# EAGLE design PDU_v1a (EAGLE 6.5.0)

## Sheet 1 of 3
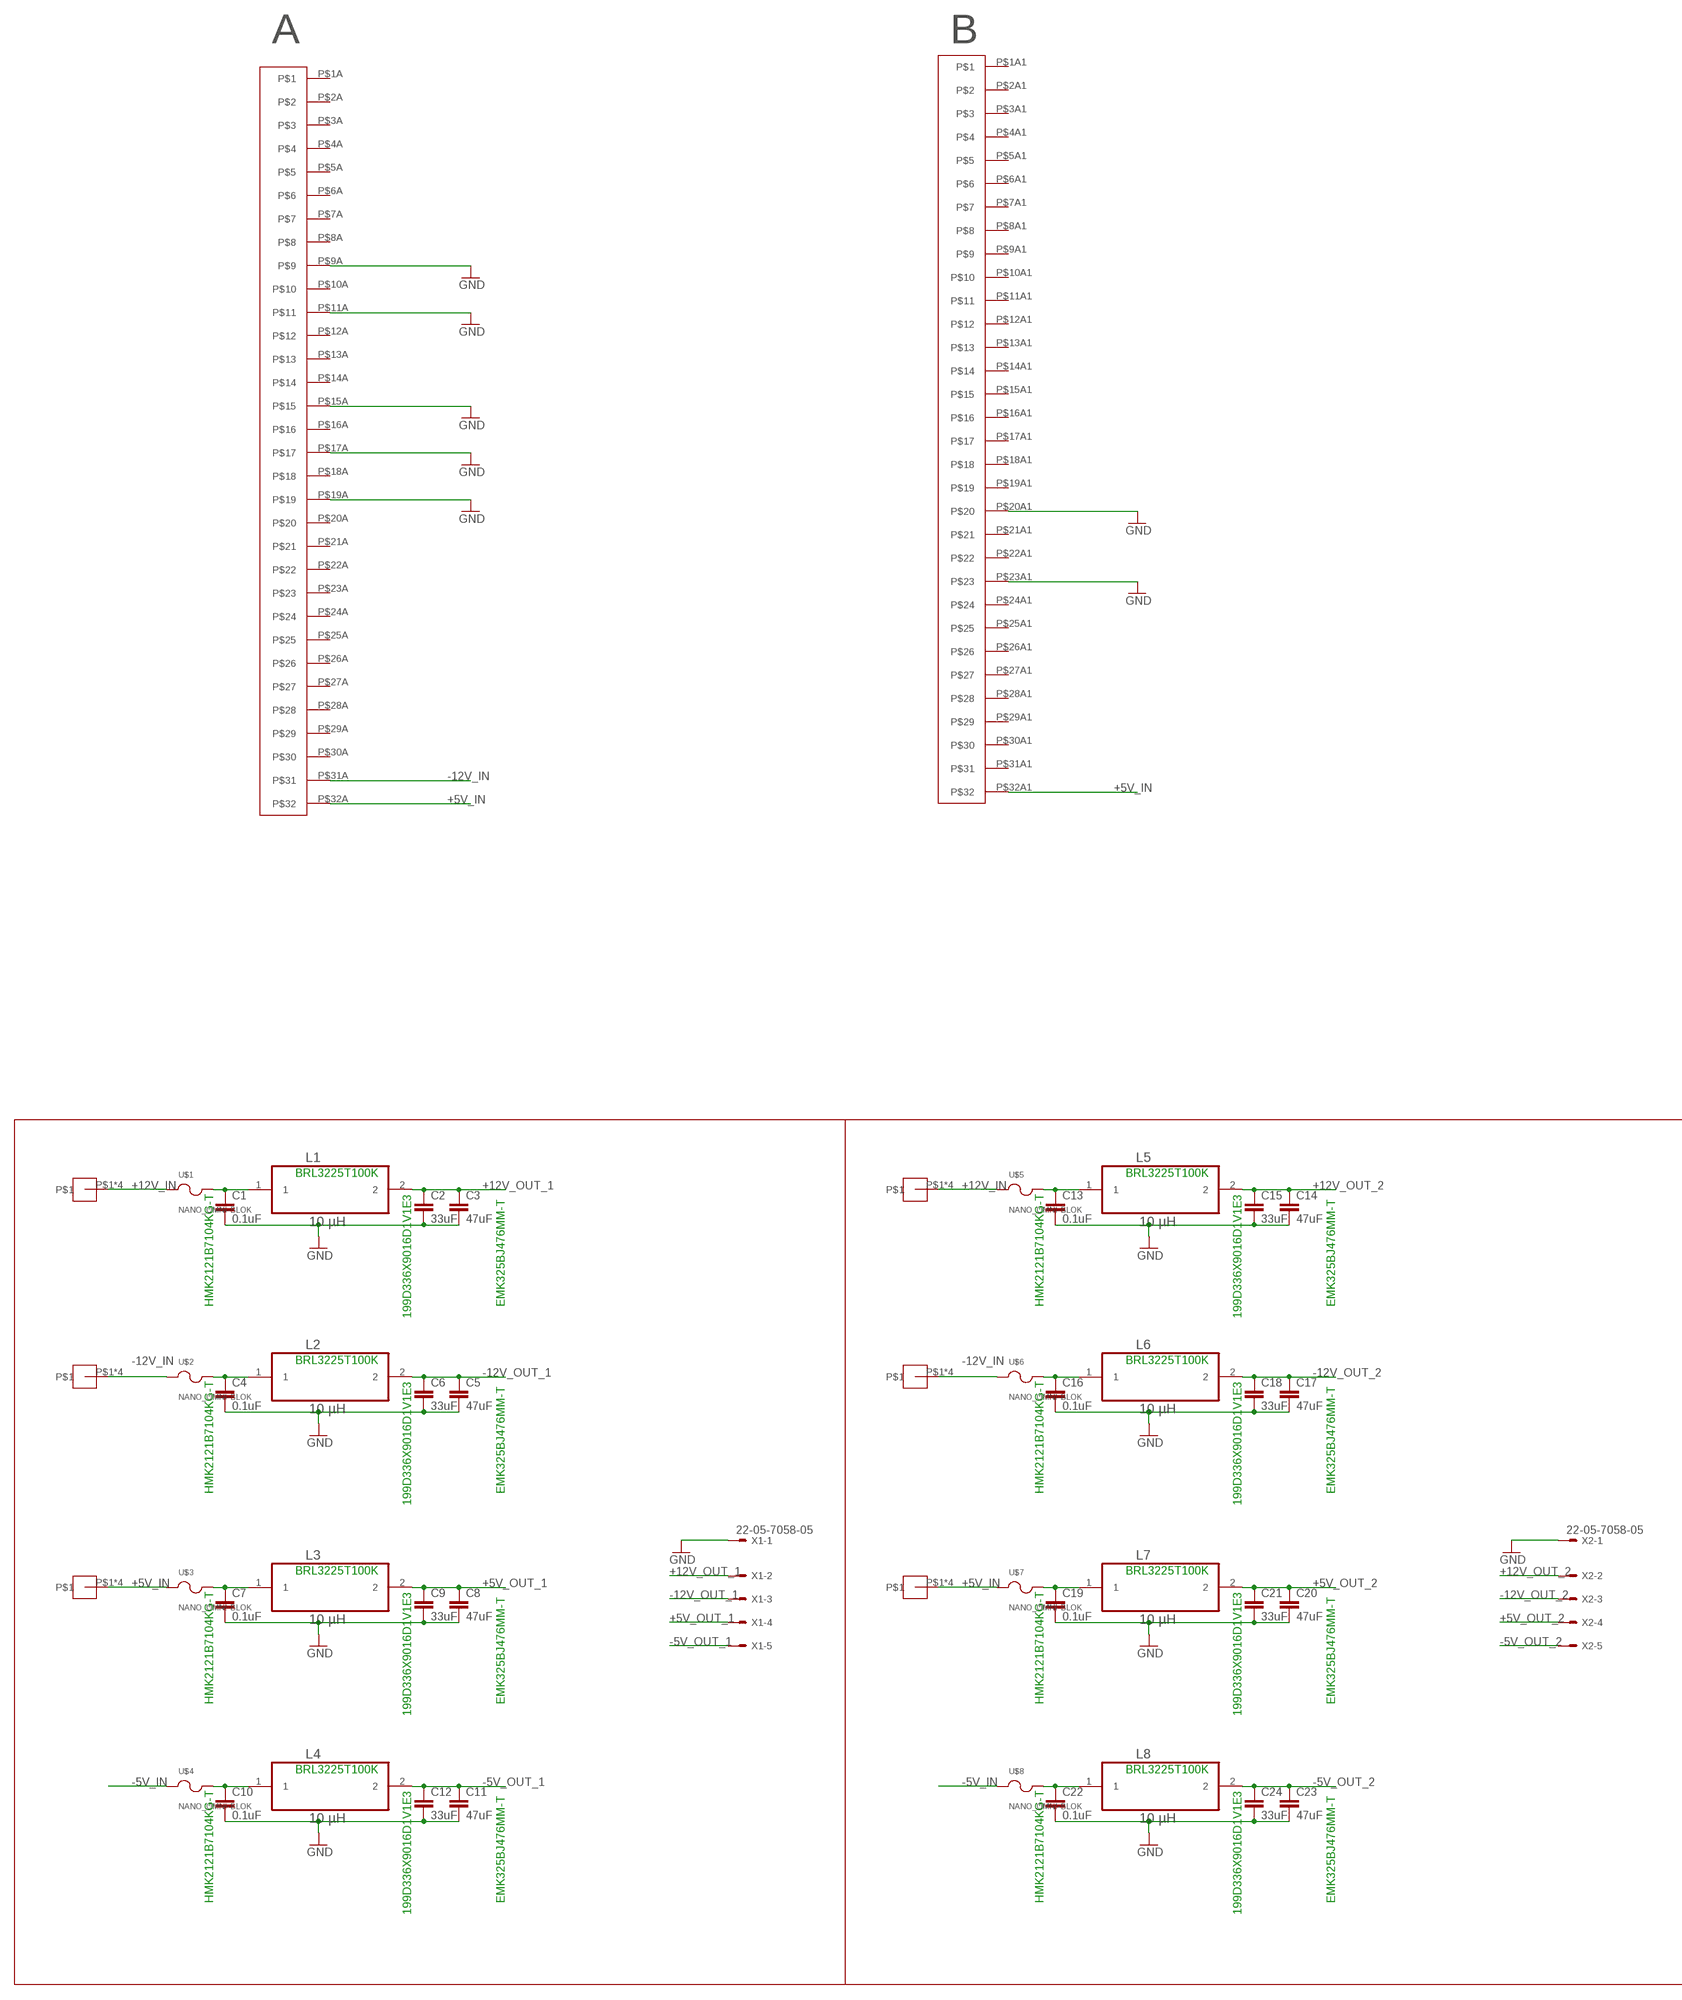
[diagram p0: schematic, sheet 1, part 1 of 2]
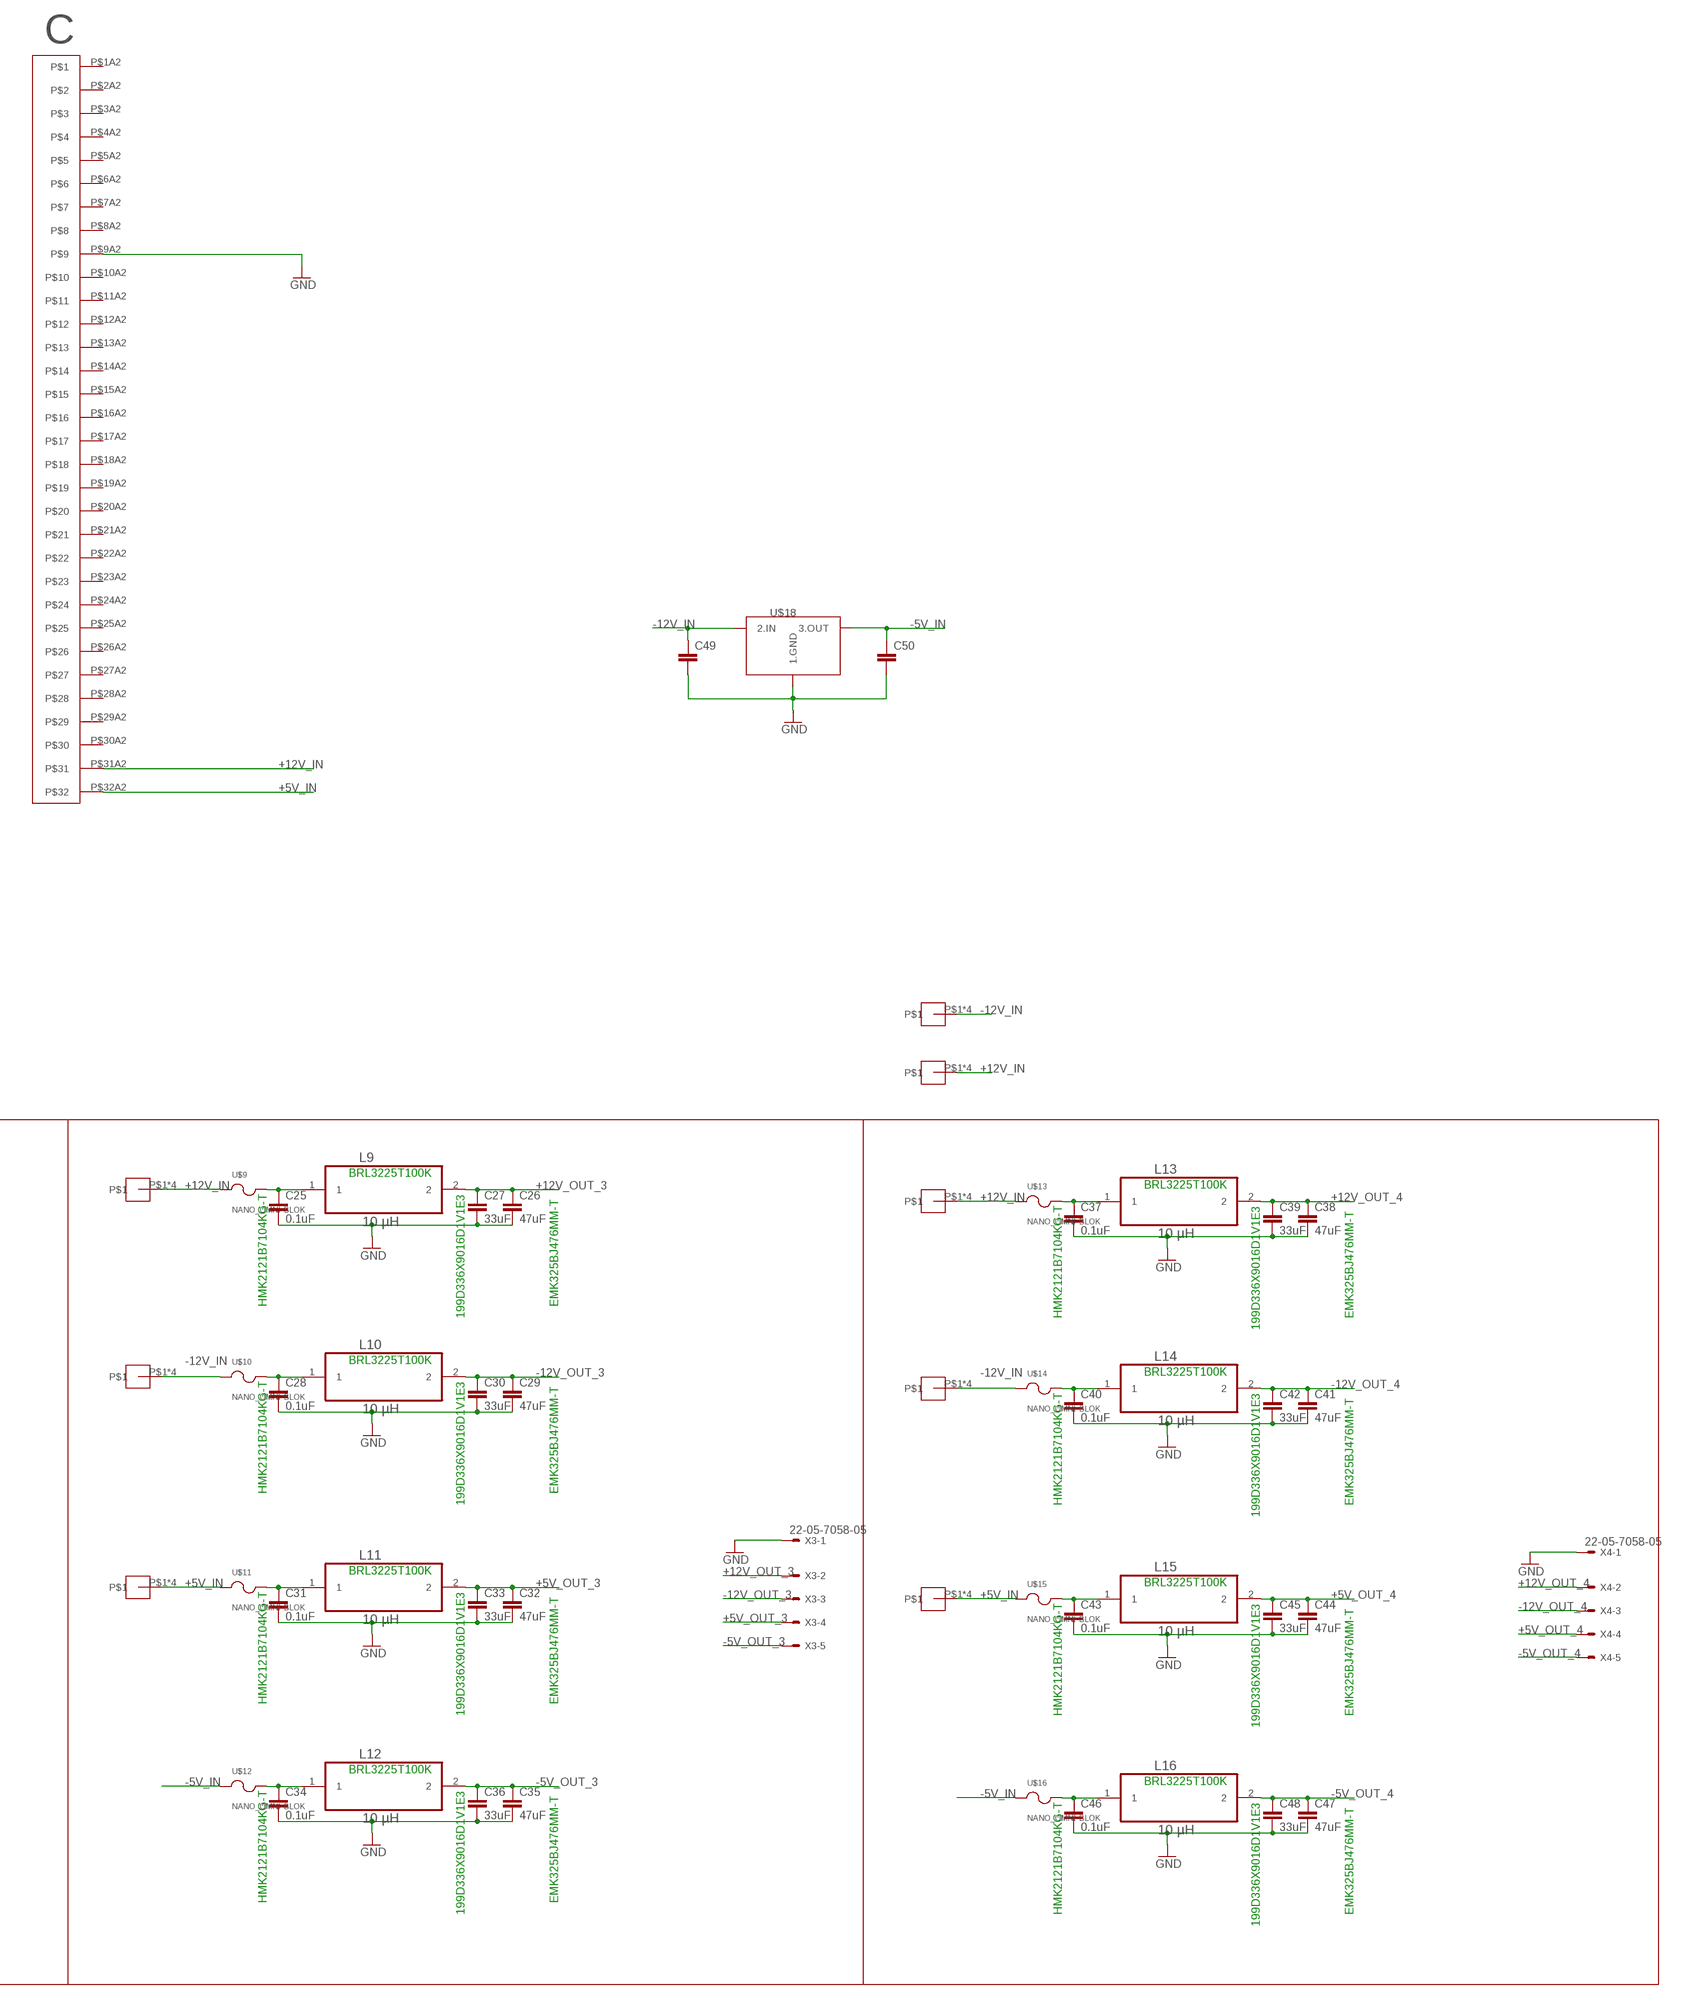
[diagram p1: schematic, sheet 1, part 2 of 2]

### Parts
+5V  POWERTAP-7691  [KEYSTONE7691]
+5V1  POWERTAP-7691  [KEYSTONE7691]
+5V2  POWERTAP-7691  [KEYSTONE7691]
+5V3  POWERTAP-7691  [KEYSTONE7691]
+12V  POWERTAP-7691  [KEYSTONE7691]
+12V1  POWERTAP-7691  [KEYSTONE7691]
+12V2  POWERTAP-7691  [KEYSTONE7691]
+12V3  POWERTAP-7691  [KEYSTONE7691]
+12V4  POWERTAP-7691  [KEYSTONE7691]
-12V  POWERTAP-7691  [KEYSTONE7691]
-12V1  POWERTAP-7691  [KEYSTONE7691]
-12V2  POWERTAP-7691  [KEYSTONE7691]
-12V3  POWERTAP-7691  [KEYSTONE7691]
-12V4  POWERTAP-7691  [KEYSTONE7691]
C1  0.1uF  C-EUC0805  [C0805]
C2  33uF  C-EU025-025X050  [C025-025X050]
C3  47uF  C-EUC1210  [C1210]
C4  0.1uF  C-EUC0805  [C0805]
C5  47uF  C-EUC1210  [C1210]
C6  33uF  C-EU025-025X050  [C025-025X050]
C7  0.1uF  C-EUC0805  [C0805]
C8  47uF  C-EUC1210  [C1210]
C9  33uF  C-EU025-025X050  [C025-025X050]
C10  0.1uF  C-EUC0805  [C0805]
C11  47uF  C-EUC1210  [C1210]
C12  33uF  C-EU025-025X050  [C025-025X050]
C13  0.1uF  C-EUC0805  [C0805]
C14  47uF  C-EUC1210  [C1210]
C15  33uF  C-EU025-025X050  [C025-025X050]
C16  0.1uF  C-EUC0805  [C0805]
C17  47uF  C-EUC1210  [C1210]
C18  33uF  C-EU025-025X050  [C025-025X050]
C19  0.1uF  C-EUC0805  [C0805]
C20  47uF  C-EUC1210  [C1210]
C21  33uF  C-EU025-025X050  [C025-025X050]
C22  0.1uF  C-EUC0805  [C0805]
C23  47uF  C-EUC1210  [C1210]
C24  33uF  C-EU025-025X050  [C025-025X050]
C25  0.1uF  C-EUC0805  [C0805]
C26  47uF  C-EUC1210  [C1210]
C27  33uF  C-EU025-025X050  [C025-025X050]
C28  0.1uF  C-EUC0805  [C0805]
C29  47uF  C-EUC1210  [C1210]
C30  33uF  C-EU025-025X050  [C025-025X050]
C31  0.1uF  C-EUC0805  [C0805]
C32  47uF  C-EUC1210  [C1210]
C33  33uF  C-EU025-025X050  [C025-025X050]
C34  0.1uF  C-EUC0805  [C0805]
C35  47uF  C-EUC1210  [C1210]
C36  33uF  C-EU025-025X050  [C025-025X050]
C37  0.1uF  C-EUC0805  [C0805]
C38  47uF  C-EUC1210  [C1210]
C39  33uF  C-EU025-025X050  [C025-025X050]
C40  0.1uF  C-EUC0805  [C0805]
C41  47uF  C-EUC1210  [C1210]
C42  33uF  C-EU025-025X050  [C025-025X050]
C43  0.1uF  C-EUC0805  [C0805]
C44  47uF  C-EUC1210  [C1210]
C45  33uF  C-EU025-025X050  [C025-025X050]
C46  0.1uF  C-EUC0805  [C0805]
C47  47uF  C-EUC1210  [C1210]
C48  33uF  C-EU025-025X050  [C025-025X050]
C49  C-EUC0805  [C0805]
C50  C-EUC0805  [C0805]
L1  10 µH  B82422H1333K  [INDC3225X240N]
L2  10 µH  B82422H1333K  [INDC3225X240N]
L3  10 µH  B82422H1333K  [INDC3225X240N]
L4  10 µH  B82422H1333K  [INDC3225X240N]
L5  10 µH  B82422H1333K  [INDC3225X240N]
L6  10 µH  B82422H1333K  [INDC3225X240N]
L7  10 µH  B82422H1333K  [INDC3225X240N]
L8  10 µH  B82422H1333K  [INDC3225X240N]
L9  10 µH  B82422H1333K  [INDC3225X240N]
L10  10 µH  B82422H1333K  [INDC3225X240N]
L11  10 µH  B82422H1333K  [INDC3225X240N]
L12  10 µH  B82422H1333K  [INDC3225X240N]
L13  10 µH  B82422H1333K  [INDC3225X240N]
L14  10 µH  B82422H1333K  [INDC3225X240N]
L15  10 µH  B82422H1333K  [INDC3225X240N]
L16  10 µH  B82422H1333K  [INDC3225X240N]
U$1  NANO_OMNI-BLOK  [NANO2-OMNI-BLOK]
U$2  NANO_OMNI-BLOK  [NANO2-OMNI-BLOK]
U$3  NANO_OMNI-BLOK  [NANO2-OMNI-BLOK]
U$4  NANO_OMNI-BLOK  [NANO2-OMNI-BLOK]
U$5  NANO_OMNI-BLOK  [NANO2-OMNI-BLOK]
U$6  NANO_OMNI-BLOK  [NANO2-OMNI-BLOK]
U$7  NANO_OMNI-BLOK  [NANO2-OMNI-BLOK]
U$8  NANO_OMNI-BLOK  [NANO2-OMNI-BLOK]
U$9  NANO_OMNI-BLOK  [NANO2-OMNI-BLOK]
U$10  NANO_OMNI-BLOK  [NANO2-OMNI-BLOK]
U$11  NANO_OMNI-BLOK  [NANO2-OMNI-BLOK]
U$12  NANO_OMNI-BLOK  [NANO2-OMNI-BLOK]
U$13  NANO_OMNI-BLOK  [NANO2-OMNI-BLOK]
U$14  NANO_OMNI-BLOK  [NANO2-OMNI-BLOK]
U$15  NANO_OMNI-BLOK  [NANO2-OMNI-BLOK]
U$16  NANO_OMNI-BLOK  [NANO2-OMNI-BLOK]
U$17  DIN_41612_PLUG  [DIN_41612_PLUG]
U$18  LM2990  [TO-263-3]
X1  22-05-7058-05  [7395-05]
X2  22-05-7058-05  [7395-05]
X3  22-05-7058-05  [7395-05]
X4  22-05-7058-05  [7395-05]

### Nets
+5V_1: C7.1 L3.1 U$3.P$2
+5V_2: C19.1 L7.1 U$7.P$2
+5V_3: C31.1 L11.1 U$11.P$2
+5V_4: C43.1 L15.1 U$15.P$2
+5V_IN: +5V1.P$1 +5V1.P$2 +5V1.P$3 +5V1.P$4 +5V2.P$1 +5V2.P$2 +5V2.P$3 +5V2.P$4 +5V3.P$1 +5V3.P$2 +5V3.P$3 +5V3.P$4 +5V.P$1 +5V.P$2 +5V.P$3 +5V.P$4 U$3.P$1 U$7.P$1 U$11.P$1 U$15.P$1 U$17.P$32A U$17.P$32A1 U$17.P$32A2
+5V_OUT_1: C8.1 C9.1 L3.2 X1.4
+5V_OUT_2: C20.1 C21.1 L7.2 X2.4
+5V_OUT_3: C32.1 C33.1 L11.2 X3.4
+5V_OUT_4: C44.1 C45.1 L15.2 X4.4
+12V_1: C1.1 L1.1 U$1.P$2
+12V_2: C13.1 L5.1 U$5.P$2
+12V_3: C25.1 L9.1 U$9.P$2
+12V_4: C37.1 L13.1 U$13.P$2
+12V_IN: +12V1.P$1 +12V1.P$2 +12V1.P$3 +12V1.P$4 +12V2.P$1 +12V2.P$2 +12V2.P$3 +12V2.P$4 +12V3.P$1 +12V3.P$2 +12V3.P$3 +12V3.P$4 +12V4.P$1 +12V4.P$2 +12V4.P$3 +12V4.P$4 +12V.P$1 +12V.P$2 +12V.P$3 +12V.P$4 U$1.P$1 U$5.P$1 U$9.P$1 U$13.P$1 U$17.P$31A2
+12V_OUT_1: C2.1 C3.1 L1.2 X1.2
+12V_OUT_2: C14.1 C15.1 L5.2 X2.2
+12V_OUT_3: C26.1 C27.1 L9.2 X3.2
+12V_OUT_4: C38.1 C39.1 L13.2 X4.2
-5V_1: C10.1 L4.1 U$4.P$2
-5V_2: C22.1 L8.1 U$8.P$2
-5V_3: C34.1 L12.1 U$12.P$2
-5V_4: C46.1 L16.1 U$16.P$2
-5V_IN: C50.1 U$4.P$1 U$8.P$1 U$12.P$1 U$16.P$1 U$18.P$3(3.OUT)
-5V_OUT_1: C11.1 C12.1 L4.2 X1.5
-5V_OUT_2: C23.1 C24.1 L8.2 X2.5
-5V_OUT_3: C35.1 C36.1 L12.2 X3.5
-5V_OUT_4: C47.1 C48.1 L16.2 X4.5
-12V_1: C4.1 L2.1 U$2.P$2
-12V_2: C16.1 L6.1 U$6.P$2
-12V_3: C28.1 L10.1 U$10.P$2
-12V_4: C40.1 L14.1 U$14.P$2
-12V_IN: -12V1.P$1 -12V1.P$2 -12V1.P$3 -12V1.P$4 -12V2.P$1 -12V2.P$2 -12V2.P$3 -12V2.P$4 -12V3.P$1 -12V3.P$2 -12V3.P$3 -12V3.P$4 -12V4.P$1 -12V4.P$2 -12V4.P$3 -12V4.P$4 -12V.P$1 -12V.P$2 -12V.P$3 -12V.P$4 C49.1 U$2.P$1 U$6.P$1 U$10.P$1 U$14.P$1 U$17.P$31A U$18.P$2(2.IN) U$18.P$4(2.IN)
-12V_OUT_1: C5.1 C6.1 L2.2 X1.3
-12V_OUT_2: C17.1 C18.1 L6.2 X2.3
-12V_OUT_3: C29.1 C30.1 L10.2 X3.3
-12V_OUT_4: C41.1 C42.1 L14.2 X4.3
GND: C1.2 C2.2 C3.2 C4.2 C5.2 C6.2 C7.2 C8.2 C9.2 C10.2 C11.2 C12.2 C13.2 C14.2 C15.2 C16.2 C17.2 C18.2 C19.2 C20.2 C21.2 C22.2 C23.2 C24.2 C25.2 C26.2 C27.2 C28.2 C29.2 C30.2 C31.2 C32.2 C33.2 C34.2 C35.2 C36.2 C37.2 C38.2 C39.2 C40.2 C41.2 C42.2 C43.2 C44.2 C45.2 C46.2 C47.2 C48.2 C49.2 C50.2 U$17.P$9A U$17.P$9A2 U$17.P$11A U$17.P$15A U$17.P$17A U$17.P$19A U$17.P$20A1 U$17.P$23A1 U$18.P$1(1.GND) X1.1 X2.1 X3.1 X4.1
Unconnected: U$17.P$1A U$17.P$1A1 U$17.P$1A2 U$17.P$2A U$17.P$2A1 U$17.P$2A2 U$17.P$3A U$17.P$3A1 U$17.P$3A2 U$17.P$4A U$17.P$4A1 U$17.P$4A2 U$17.P$5A U$17.P$5A1 U$17.P$5A2 U$17.P$6A U$17.P$6A1 U$17.P$6A2 U$17.P$7A U$17.P$7A1 U$17.P$7A2 U$17.P$8A U$17.P$8A1 U$17.P$8A2 U$17.P$9A1 U$17.P$10A U$17.P$10A1 U$17.P$10A2 U$17.P$11A1 U$17.P$11A2 U$17.P$12A U$17.P$12A1 U$17.P$12A2 U$17.P$13A U$17.P$13A1 U$17.P$13A2 U$17.P$14A U$17.P$14A1 U$17.P$14A2 U$17.P$15A1 U$17.P$15A2 U$17.P$16A U$17.P$16A1 U$17.P$16A2 U$17.P$17A1 U$17.P$17A2 U$17.P$18A U$17.P$18A1 U$17.P$18A2 U$17.P$19A1 U$17.P$19A2 U$17.P$20A U$17.P$20A2 U$17.P$21A U$17.P$21A1 U$17.P$21A2 U$17.P$22A U$17.P$22A1 U$17.P$22A2 U$17.P$23A U$17.P$23A2 U$17.P$24A U$17.P$24A1 U$17.P$24A2 U$17.P$25A U$17.P$25A1 U$17.P$25A2 U$17.P$26A U$17.P$26A1 U$17.P$26A2 U$17.P$27A U$17.P$27A1 U$17.P$27A2 U$17.P$28A U$17.P$28A1 U$17.P$28A2 U$17.P$29A U$17.P$29A1 U$17.P$29A2 U$17.P$30A U$17.P$30A1 U$17.P$30A2 U$17.P$31A1

### Notes on the sheet
- A | B | C
- BRL3225T100K | BRL3225T100K | BRL3225T100K
- BRL3225T100K
- HMK2121B7104KG-T | EMK325BJ476MM-T | HMK2121B7104KG-T | EMK325BJ476MM-T | HMK2121B7104KG-T | EMK325BJ476MM-T
- 199D336X9016D1V1E3 | 199D336X9016D1V1E3 | 199D336X9016D1V1E3 | HMK2121B7104KG-T | EMK325BJ476MM-T
- 199D336X9016D1V1E3
- BRL3225T100K | BRL3225T100K | BRL3225T100K
- BRL3225T100K
- HMK2121B7104KG-T | EMK325BJ476MM-T | HMK2121B7104KG-T | EMK325BJ476MM-T | HMK2121B7104KG-T | EMK325BJ476MM-T
- 199D336X9016D1V1E3 | 199D336X9016D1V1E3 | 199D336X9016D1V1E3 | HMK2121B7104KG-T | EMK325BJ476MM-T
- 199D336X9016D1V1E3
- BRL3225T100K | BRL3225T100K | BRL3225T100K
- BRL3225T100K
- HMK2121B7104KG-T | EMK325BJ476MM-T | HMK2121B7104KG-T | EMK325BJ476MM-T | HMK2121B7104KG-T | EMK325BJ476MM-T
- 199D336X9016D1V1E3 | 199D336X9016D1V1E3 | 199D336X9016D1V1E3 | HMK2121B7104KG-T | EMK325BJ476MM-T
- 199D336X9016D1V1E3
- BRL3225T100K | BRL3225T100K | BRL3225T100K
- BRL3225T100K
- HMK2121B7104KG-T | EMK325BJ476MM-T | HMK2121B7104KG-T | EMK325BJ476MM-T | HMK2121B7104KG-T | EMK325BJ476MM-T
- 199D336X9016D1V1E3 | 199D336X9016D1V1E3 | 199D336X9016D1V1E3 | HMK2121B7104KG-T | EMK325BJ476MM-T
- 199D336X9016D1V1E3

## Sheet 2 of 3

## Sheet 3 of 3

## Library data of the parts
+5V +5V1-+5V3 +12V +12V1-+12V4 -12V -12V1--12V4 = PowerTaps:POWERTAP-7691
C1-C50 = rcl:C-EU: CAPACITOR, European symbol
L1-L16 = Epcos_By_element14_Batch_1:B82422H1333K: INDUCTOR 33UH 280MA 1210 10%; MPN: B82422H1333K; OC_FARNELL: 1299977; OC_NEWARK: 25M8338; SUPPLIER: EPCOS Inc; TOLERANCE: ±10%; VALUE: 33 µH
U$1-U$16 = ad8512:NANO_OMNI-BLOK
U$17 = ebutt:DIN_41612_PLUG
U$18 = ebutt:LM2990
X1-X4 = con-molex:22-?-05: CONNECTOR wire to board 2.54 mm (.1 inch) pitch header; OC_FARNELL: unknown; OC_NEWARK: unknown

## Board
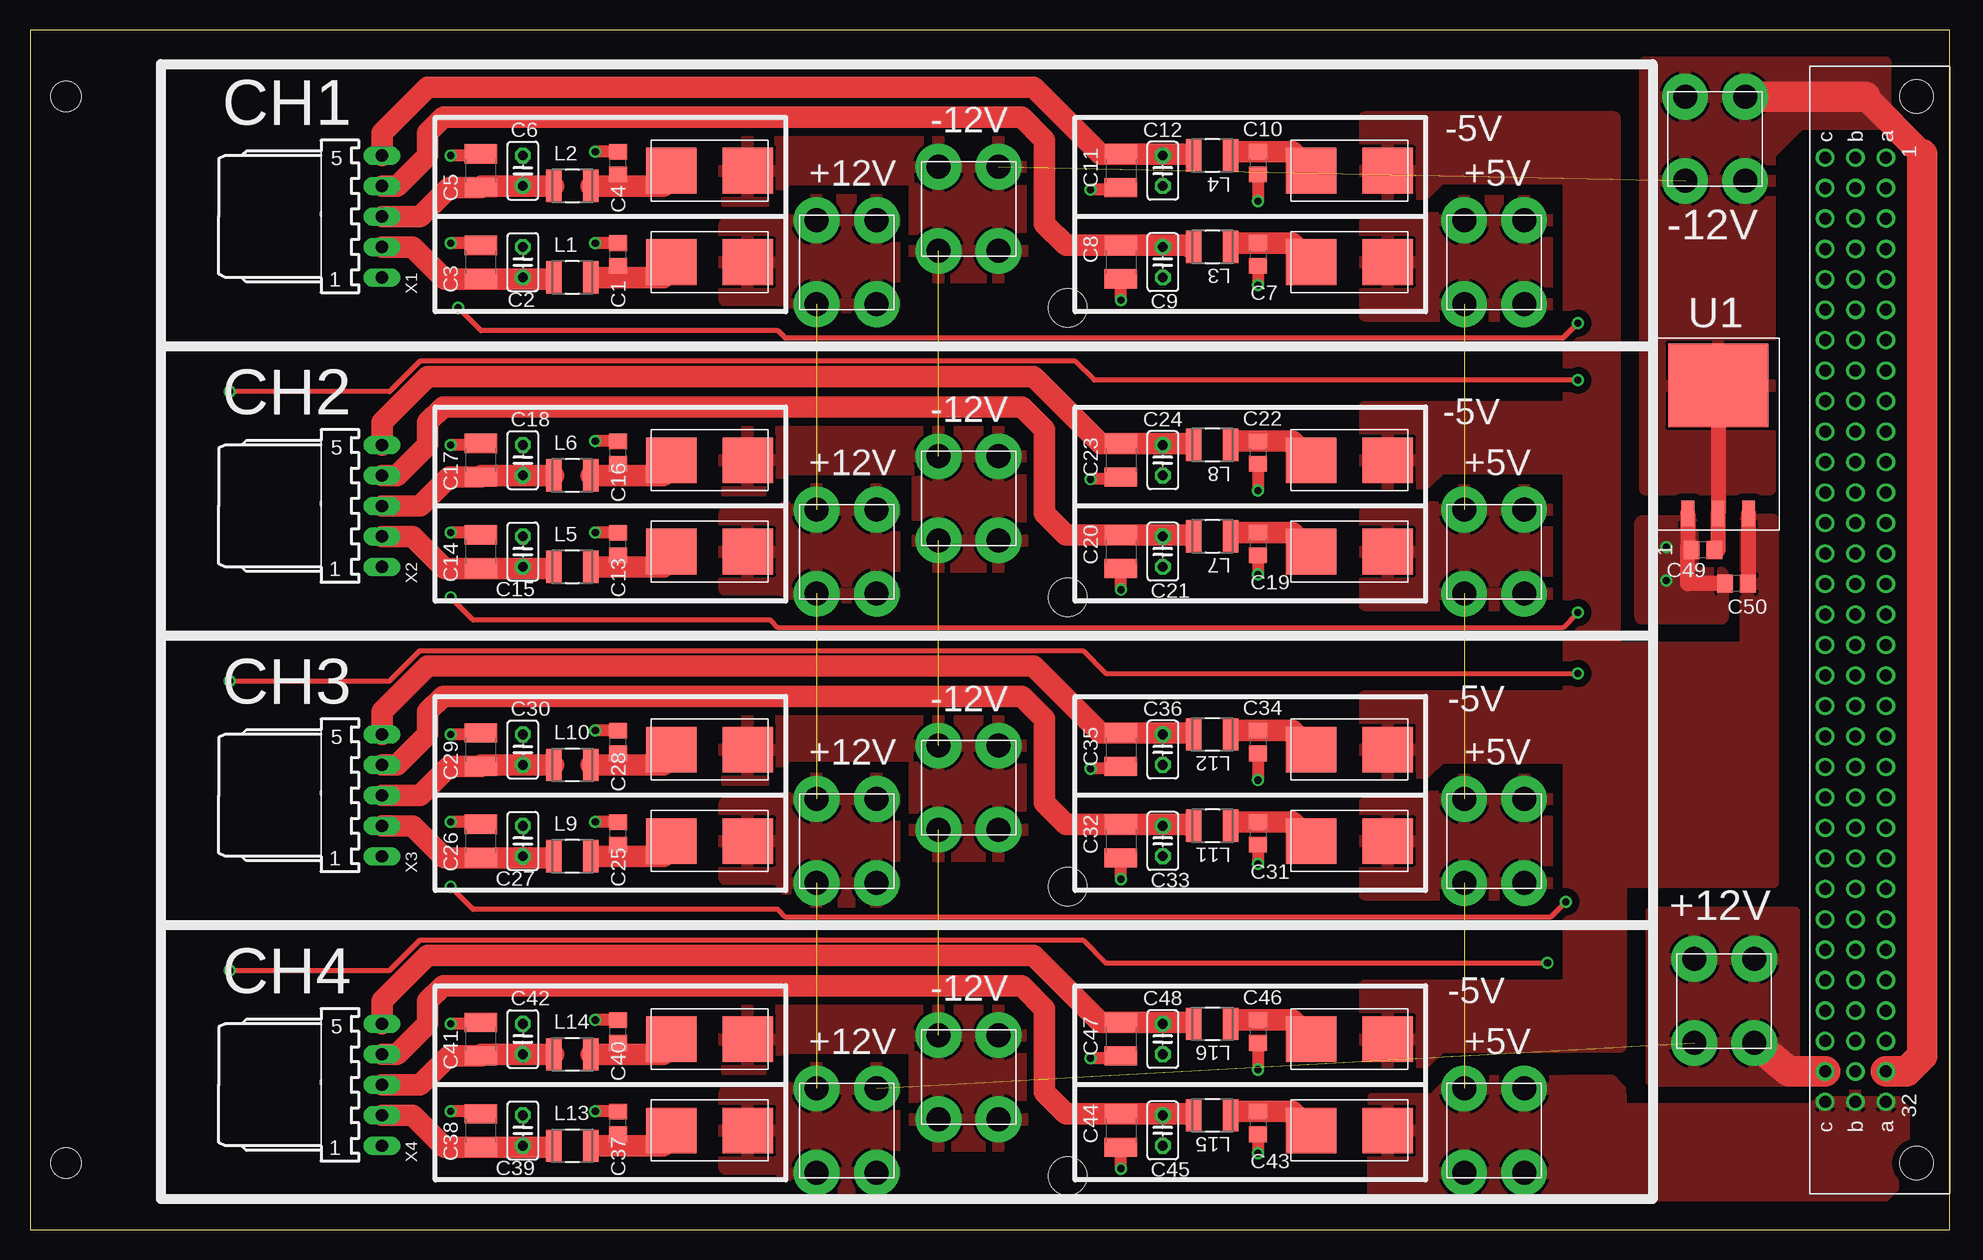
[diagram p2: board, top side]
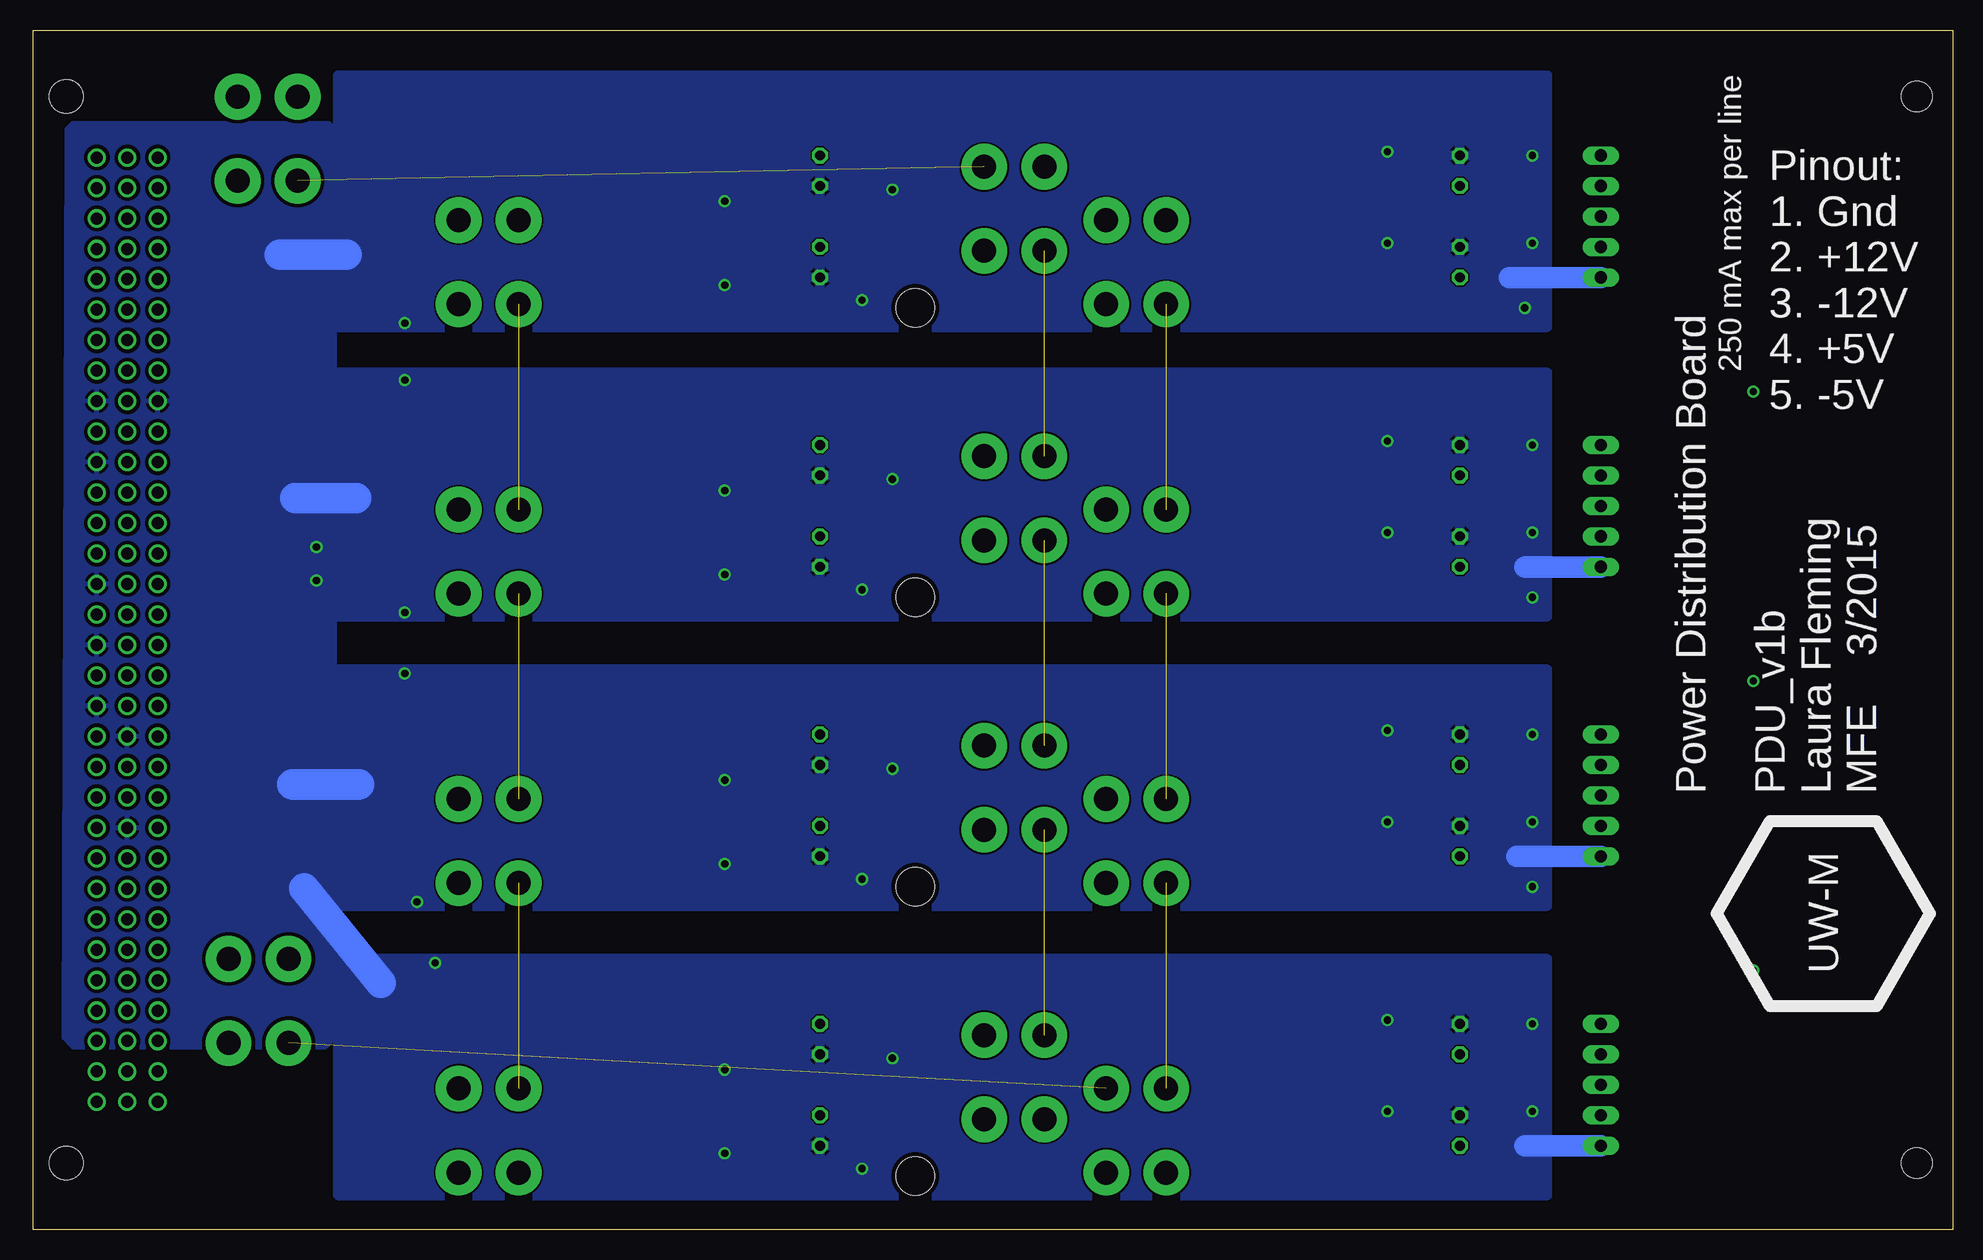
[diagram p3: board, bottom side, seen from below]

Size 160 x 100 mm. Coordinates in mm from the lower left corner, seen from the top.
Outline: 0,0 160,0 160,100 0,100 0,0
Copper layers (1*16): Top 0.035559375mm / dielectric 1.501140625mm / Bottom 0.035559375mm
Design rules "typical_4pcb": minimum track width 10mil, minimum drill 15mil, track to track 6mil, track to pad 6mil, pad to pad 6mil, via to via 6mil, smd to smd 6mil, copper to edge 15mil, drill to drill 8mil, minimum pad ring 10mil, minimum via ring 8mil, stop-mask expansion 4mil, vias tented up to drill 20mil, thermal gap 10mil
Holes 3.2 mm at 86.49,76.83 86.49,52.7 86.49,28.57 86.49,4.45
Holes 2.55 mm at 3,5.55 3,94.45

### Footprints (pad centres in the part's own frame; a part is rotated, then mirrored left to right if it is on the bottom)
KEYSTONE7691 = drill 2 pad 3.81: P$1 -3.505,-2.502; P$2 -3.505,2.502; P$3 3.505,-2.502; P$4 3.505,2.502
C0805 = smd 1.3 x 1.5: 1 -0.95,0; 2 0.95,0
C025-025X050 = drill 0.813 octagon: 1 -1.27,0; 2 1.27,0
C1210 = smd 1.6 x 2.7: 1 -1.4,0; 2 1.4,0
INDC3225X240N = smd 1.295 x 2.692: 1 -1.549,0; 2 1.549,0
NANO2-OMNI-BLOK = smd 4.242 x 3.81: P$1 -3.188,0; P$2 3.188,0
DIN_41612_PLUG = drill 1: P$1A 39.37,0; P$1A1 39.37,2.54; P$1A2 39.37,5.08; P$2A 36.83,0; P$2A1 36.83,2.54; P$2A2 36.83,5.08; P$3A 34.29,0; P$3A1 34.29,2.54; P$3A2 34.29,5.08; P$4A 31.75,0; P$4A1 31.75,2.54; P$4A2 31.75,5.08; P$5A 29.21,0; P$5A1 29.21,2.54; P$5A2 29.21,5.08; P$6A 26.67,0; P$6A1 26.67,2.54; P$6A2 26.67,5.08; P$7A 24.13,0; P$7A1 24.13,2.54; P$7A2 24.13,5.08; P$8A 21.59,0; P$8A1 21.59,2.54; P$8A2 21.59,5.08; P$9A 19.05,0; P$9A1 19.05,2.54; P$9A2 19.05,5.08; P$10A 16.51,0; P$10A1 16.51,2.54; P$10A2 16.51,5.08; P$11A 13.97,0; P$11A1 13.97,2.54; P$11A2 13.97,5.08; P$12A 11.43,0; P$12A1 11.43,2.54; P$12A2 11.43,5.08; P$13A 8.89,0; P$13A1 8.89,2.54; P$13A2 8.89,5.08; P$14A 6.35,0; P$14A1 6.35,2.54; P$14A2 6.35,5.08; P$15A 3.81,0; P$15A1 3.81,2.54; P$15A2 3.81,5.08; P$16A 1.27,0; P$16A1 1.27,2.54; P$16A2 1.27,5.08; P$17A -1.27,0; P$17A1 -1.27,2.54; P$17A2 -1.27,5.08; P$18A -3.81,0; P$18A1 -3.81,2.54; P$18A2 -3.81,5.08; P$19A -6.35,0; P$19A1 -6.35,2.54; P$19A2 -6.35,5.08; P$20A -8.89,0; P$20A1 -8.89,2.54; P$20A2 -8.89,5.08; P$21A -11.43,0; P$21A1 -11.43,2.54; P$21A2 -11.43,5.08; P$22A -13.97,0; P$22A1 -13.97,2.54; P$22A2 -13.97,5.08; P$23A -16.51,0; P$23A1 -16.51,2.54; P$23A2 -16.51,5.08; P$24A -19.05,0; P$24A1 -19.05,2.54; P$24A2 -19.05,5.08; P$25A -21.59,0; P$25A1 -21.59,2.54; P$25A2 -21.59,5.08; P$26A -24.13,0; P$26A1 -24.13,2.54; P$26A2 -24.13,5.08; P$27A -26.67,0; P$27A1 -26.67,2.54; P$27A2 -26.67,5.08; P$28A -29.21,0; P$28A1 -29.21,2.54; P$28A2 -29.21,5.08; P$29A -31.75,0; P$29A1 -31.75,2.54; P$29A2 -31.75,5.08; P$30A -34.29,0; P$30A1 -34.29,2.54; P$30A2 -34.29,5.08; P$31A -36.83,0; P$31A1 -36.83,2.54; P$31A2 -36.83,5.08; P$32A -39.37,0; P$32A1 -39.37,2.54; P$32A2 -39.37,5.08 | hole 2.8: 44.45,-2.54; -44.45,-2.54
TO-263-3 = smd 2.159 x 1.067: P$1 0,-2.54; P$2 0,0; P$3 0,2.54 | smd 6.985 x 8.331: P$4 -10.681,0
7395-05 = drill 1.016 long: 1 5.08,0; 2 2.54,0; 3 0,0; 4 -2.54,0; 5 -5.08,0

### Placement (x,y rotation side)
+5V  122.05,80.64 90 top
+5V1  122.05,56.52 90 top
+5V2  122.05,32.38 90 top
+5V3  122.05,8.26 90 top
+12V  68.07,80.64 270 top
+12V1  68.07,56.52 270 top
+12V2  68.07,32.38 270 top
+12V3  68.07,8.26 270 top
+12V4  141.22,19.05 90 top
-12V  78.23,85.09 90 top
-12V1  78.23,60.96 90 top
-12V2  78.23,36.83 90 top
-12V3  78.23,12.7 90 top
-12V4  140.46,90.93 90 top
C1  49.02,81.28 90 top
C2  41.08,80.64 90 top
C3  37.59,80.64 90 top
C4  49.02,88.9 90 top
C5  37.59,88.27 90 top
C6  41.08,88.27 90 top
C7  102.36,81.28 270 top
C8  90.93,80.64 270 top
C9  94.42,80.64 270 top
C10  102.36,88.9 270 top
C11  90.93,88.27 270 top
C12  94.42,88.27 270 top
C13  49.02,57.15 90 top
C14  37.59,56.52 90 top
C15  41.08,56.52 90 top
C16  49.02,64.77 90 top
C17  37.59,64.14 90 top
C18  41.08,64.14 90 top
C19  102.36,57.15 270 top
C20  90.93,56.52 270 top
C21  94.42,56.52 270 top
C22  102.36,64.77 270 top
C23  90.93,64.14 270 top
C24  94.42,64.14 270 top
C25  49.02,33.02 90 top
C26  37.59,32.38 90 top
C27  41.08,32.38 90 top
C28  49.02,40.64 90 top
C29  37.59,40.01 90 top
C30  41.08,40.01 90 top
C31  102.36,33.02 270 top
C32  90.93,32.38 270 top
C33  94.42,32.38 270 top
C34  102.36,40.64 270 top
C35  90.93,40.01 270 top
C36  94.42,40.01 270 top
C37  49.02,8.89 90 top
C38  37.59,8.26 90 top
C39  41.08,8.26 90 top
C40  49.02,16.51 90 top
C41  37.59,15.88 90 top
C42  41.08,15.88 90 top
C43  102.36,8.89 270 top
C44  90.93,8.26 270 top
C45  94.42,8.26 270 top
C46  102.36,16.51 270 top
C47  90.93,15.88 270 top
C48  94.42,15.88 270 top
C49  139.45,56.64 180 top
C50  142.24,53.85 180 top
L1  45.21,79.38 180 top
L2  45.21,87 180 top
L3  98.55,81.92 180 top
L4  98.55,89.53 180 top
L5  45.21,55.24 180 top
L6  45.21,62.87 180 top
L7  98.55,57.78 180 top
L8  98.55,65.41 180 top
L9  45.21,31.11 180 top
L10  45.21,38.73 180 top
L11  98.55,33.66 180 top
L12  98.55,41.27 180 top
L13  45.21,6.99 180 top
L14  45.21,14.61 180 top
L15  98.55,9.53 180 top
L16  98.55,17.14 180 top
U$1  56.64,80.64 180 top
U$2  56.64,88.27 180 top
U$3  109.98,80.64 180 top
U$4  109.98,88.27 180 top
U$5  56.64,56.52 180 top
U$6  56.64,64.14 180 top
U$7  109.98,56.52 180 top
U$8  109.98,64.14 180 top
U$9  56.64,32.38 180 top
U$10  56.64,40.01 180 top
U$11  109.98,32.38 180 top
U$12  109.98,40.01 180 top
U$13  56.64,8.26 180 top
U$14  56.64,15.88 180 top
U$15  109.98,8.26 180 top
U$16  109.98,15.88 180 top
U$17  154.71,50 90 top
U$18  140.72,59.69 270 top
X1  29.34,84.45 270 top
X2  29.34,60.33 270 top
X3  29.34,36.2 270 top
X4  29.34,12.06 270 top

### Tracks (layer width: path | path; a pad name or v marks a point on that pad's centre or on a via)
+5V_1
  Top 1.27: 100.42,82.23 L3.1
  Top 1.778: 100.42,82.23 C7.1 105.21,82.23 U$3.P$2
+5V_2
  Top 1.27: 100.42,58.1 L7.1
  Top 1.778: 100.42,58.1 C19.1 105.21,58.1 U$7.P$2
+5V_3
  Top 1.27: 100.42,33.97 L11.1
  Top 1.778: 100.42,33.97 C31.1 105.21,33.97 U$11.P$2
+5V_4
  Top 1.27: 100.42,9.84 L15.1
  Top 1.778: 100.42,9.84 C43.1 105.21,9.84 U$15.P$2
+5V_IN  (3 unrouted)
  pour Top (isolate 0.61): 111.25,83.82 111.25,76.2 126.49,76.2 126.49,85.72 118.24,85.72 116.33,83.82
  pour Top (isolate 0.61): 111.25,59.69 111.25,52.07 126.49,52.07 126.49,61.59 118.24,61.59 116.33,59.69
  pour Top (isolate 0.61): 111.25,35.56 111.25,27.94 126.49,27.94 126.49,37.47 118.24,37.47 116.33,35.56
  pour Top (isolate 0.61): 149.75,11.2 155,11.2 156.2,10 156.2,4.4 154.6,2.8 116.78,2.8 115.58,2.73 111.96,2.73 111.97,5.26 111.97,9.06 111.9,10.9 116.98,10.9 118.48,12.4 124.48,12.4 131.77,12.48 132.53,11.66 132.61,10.06 148.61,10.06
+5V_OUT_1
  Top 1.27: L3.2 96.65,81.92 | C9.1 94.87,82.05 95.38,82.05
  Top 1.778: X1.4 30.61,87 33.15,89.53 33.15,91.44 34.42,92.71 82.68,92.71 84.58,90.81 84.58,83.82 86.36,82.05 C8.1 95.38,82.05 96.52,82.05 96.65,81.92
+5V_OUT_2
  Top 1.27: L7.2 96.65,57.78 | C21.1 94.87,57.91 95.38,57.91
  Top 1.778: X2.4 30.61,62.87 33.15,65.41 33.15,67.31 34.42,68.58 82.68,68.58 84.58,66.67 84.58,59.69 86.36,57.91 C20.1 95.38,57.91 96.52,57.91 96.65,57.78
+5V_OUT_3
  Top 1.27: L11.2 96.65,33.66 | C33.1 94.87,33.78 95.38,33.78
  Top 1.778: X3.4 30.61,38.73 33.15,41.27 33.15,43.18 34.42,44.45 82.68,44.45 84.58,42.55 84.58,35.56 86.36,33.78 C32.1 95.38,33.78 96.52,33.78 96.65,33.66
+5V_OUT_4
  Top 1.27: L15.2 96.65,9.53 | C45.1 94.87,9.65 95.38,9.65
  Top 1.778: X4.4 30.61,14.61 33.15,17.14 33.15,19.05 34.42,20.32 82.68,20.32 84.58,18.41 84.58,11.43 86.36,9.65 C44.1 95.38,9.65 96.52,9.65 96.65,9.53
+12V_1
  Top 0.406: 51.56,79.69 51.56,79.38 52.83,79.38 53.45,79.38 U$1.P$2
  Top 1.016: C1.1 49.02,79.38
  Top 1.27: L1.1 47.12,79.38
  Top 1.778: 52.83,79.38 49.02,79.38 47.12,79.38
+12V_2
  Top 0.406: 51.56,55.56 51.56,55.24 52.83,55.24 53.45,55.24 U$5.P$2
  Top 1.016: C13.1 49.02,55.24
  Top 1.27: L5.1 47.12,55.24
  Top 1.778: 52.83,55.24 49.02,55.24 47.12,55.24
+12V_3
  Top 0.406: 51.56,31.43 51.56,31.11 52.83,31.11 53.45,31.11 U$9.P$2
  Top 1.016: C25.1 49.02,31.11
  Top 1.27: L9.1 47.12,31.11
  Top 1.778: 52.83,31.11 49.02,31.11 47.12,31.11
+12V_4
  Top 0.406: 51.56,7.3 51.56,6.99 52.83,6.99 53.45,6.99 U$13.P$2
  Top 1.016: C37.1 49.02,6.99
  Top 1.27: L13.1 47.12,6.99
  Top 1.778: 52.83,6.99 49.02,6.99 47.12,6.99
+12V_IN  (4 unrouted)
  Top 2.54: U$17.P$31A2 146.61,13.17 +12V4.P$1
  pour Top (isolate 0.61): 57.91,83.82 62.61,83.82 64.64,85.85 70.99,85.85 72.01,85.09 72.01,76.83 65.53,76.83 62.36,77.47 57.91,77.47
  pour Top (isolate 0.61): 57.91,59.69 62.36,59.69 64.39,61.72 70.74,61.72 72.01,60.45 72.01,52.7 64.26,52.7 62.36,53.34 57.91,53.34
  pour Top (isolate 0.61): 57.91,35.56 62.36,35.56 64.9,37.59 71.25,37.59 72.01,36.83 72.01,28.57 70.48,27.05 64.01,27.05 62.36,29.21 57.91,29.21
  pour Top (isolate 0.61): 57.91,11.43 62.36,11.43 64.9,13.46 71.25,13.46 72.01,12.7 72.01,4.45 71.25,3.17 64.26,3.17 62.36,5.08 57.91,5.08
  pour Top (isolate 0.406): 135.13,26.42 135.13,12.45 147.07,12.45 147.07,26.42
+12V_OUT_1
  Top 1.27: L1.2 43.31,79.38 43.18,79.25 | C2.1 41.08,79.25
  Top 1.778: X1.2 31.88,81.92 34.55,79.25 C3.1 41.08,79.25 43.18,79.25
+12V_OUT_2
  Top 1.27: L5.2 43.31,55.24 43.18,55.12 | C15.1 41.08,55.12
  Top 1.778: X2.2 31.88,57.78 34.55,55.12 C14.1 41.08,55.12 43.18,55.12
+12V_OUT_3
  Top 1.27: L9.2 43.31,31.11 43.18,30.98 | C27.1 41.08,30.98
  Top 1.778: X3.2 31.88,33.66 34.55,30.98 C26.1 41.08,30.98 43.18,30.98
+12V_OUT_4
  Top 1.27: L13.2 43.31,6.99 43.18,6.86 | C39.1 41.08,6.86
  Top 1.778: X4.2 31.88,9.53 34.55,6.86 C38.1 41.08,6.86 43.18,6.86
-5V_1
  Top 1.27: L4.1 100.46,89.53 100.46,89.85
  Top 1.778: U$4.P$2 105.21,89.85 C10.1 100.46,89.85
-5V_2
  Top 1.27: L8.1 100.46,65.41 100.46,65.72
  Top 1.778: U$8.P$2 105.21,65.72 C22.1 100.46,65.72
-5V_3
  Top 1.27: L12.1 100.46,41.27 100.46,41.59
  Top 1.778: U$12.P$2 105.21,41.59 C34.1 100.46,41.59
-5V_4
  Top 1.27: L16.1 100.46,17.14 100.46,17.46
  Top 1.778: U$16.P$2 105.21,17.46 C46.1 100.46,17.46
-5V_IN
  Top 1.27: C50.1 143.26,53.85 U$18.P$3
  pour Top (isolate 0.61): 111.25,92.71 111.25,86.36 116.33,86.36 117.6,87.63 128.4,87.63 128.4,81.92 129.67,80.64 132.08,80.64 132.08,92.71
  pour Top (isolate 0.61): 111.25,68.58 111.25,62.23 116.33,62.23 117.6,63.5 128.4,63.5 128.4,57.78 129.67,56.52 132.08,56.52 132.08,68.58
  pour Top (isolate 0.61): 111.25,44.45 111.25,38.1 116.33,38.1 117.6,39.37 128.4,39.37 128.4,33.66 129.67,32.38 145.29,32.38 145.29,44.45
  pour Top (isolate 0.61): 111.25,20.32 111.25,13.97 116.33,13.97 117.6,15.24 128.4,15.24 128.4,15.37 132.59,15.37 132.59,20.32
  pour Top (isolate 0.61): 143,59.18 145.29,59.18 145.29,28.96 132.59,28.96 132.59,15.24 128.27,15.24 128.27,92.71 132.08,92.71 132.08,48.51 143,48.51
-5V_OUT_1
  Top 1.27: L4.2 96.65,89.53 96.65,89.67 | C12.1 94.87,89.67 95.38,89.67
  Top 1.778: 96.65,89.67 95.38,89.67 C11.1 89.22,89.67 83.63,95.25 33.15,95.25 29.34,91.44 X1.5
-5V_OUT_2
  Top 1.27: L8.2 96.65,65.41 96.65,65.53 | C24.1 94.87,65.53 95.38,65.53
  Top 1.778: 96.65,65.53 95.38,65.53 C23.1 89.22,65.53 83.63,71.12 33.15,71.12 29.34,67.31 X2.5
-5V_OUT_3
  Top 1.27: L12.2 96.65,41.27 96.65,41.41 | C36.1 94.87,41.41 95.38,41.41
  Top 1.778: 96.65,41.41 95.38,41.41 C35.1 89.22,41.41 83.63,46.99 33.15,46.99 29.34,43.18 X3.5
-5V_OUT_4
  Top 1.27: L16.2 96.65,17.14 96.65,17.27 | C48.1 94.87,17.27 95.38,17.27
  Top 1.778: 96.65,17.27 95.38,17.27 C47.1 89.22,17.27 83.63,22.86 33.15,22.86 29.34,19.05 X4.5
-12V_1
  Top 0.406: 51.56,87.31 51.56,87 52.83,87 53.45,87 U$2.P$2
  Top 1.016: C4.1 49.02,87
  Top 1.778: L2.1 49.02,87 52.83,87
-12V_2
  Top 0.406: 51.56,63.19 51.56,62.87 52.83,62.87 53.45,62.87 U$6.P$2
  Top 1.016: C16.1 49.02,62.87
  Top 1.778: L6.1 49.02,62.87 52.83,62.87
-12V_3
  Top 0.406: 51.56,39.05 51.56,38.73 52.83,38.73 53.45,38.73 U$10.P$2
  Top 1.016: C28.1 49.02,38.73
  Top 1.778: L10.1 49.02,38.73 52.83,38.73
-12V_4
  Top 0.406: 51.56,14.93 51.56,14.61 52.83,14.61 53.45,14.61 U$14.P$2
  Top 1.016: C40.1 49.02,14.61
  Top 1.778: L14.1 49.02,14.61 52.83,14.61
-12V_IN  (4 unrouted)
  Top 1.27: C49.1 140.72,56.64 U$18.P$2 U$18.P$4
  Top 2.184: 157.73,89.66 152.96,94.44
  Top 2.54: U$17.P$31A 156.43,13.17 157.73,14.48 157.73,89.66 | 152.96,94.44 -12V4.P$3
  pour Top (isolate 0.61): 57.91,90.81 81.41,90.81 82.68,89.53 82.68,80.64 81.41,79.38 75.06,79.38 73.79,80.64 73.79,87.5 63.12,87.5 61.34,85.72 57.91,85.72
  pour Top (isolate 0.61): 57.91,66.67 81.41,66.67 82.68,65.41 82.68,56.52 81.41,55.24 75.31,55.24 74.04,56.52 74.04,63.37 63.12,63.37 61.09,61.59 57.91,61.59
  pour Top (isolate 0.61): 57.91,42.55 81.41,42.55 82.68,41.27 82.68,32.38 81.41,31.11 75.06,31.11 73.79,32.38 73.79,39.5 63.12,39.5 61.34,37.47 57.91,37.47
  pour Top (isolate 0.61): 57.91,18.41 81.41,18.41 82.68,17.14 82.68,8.26 81.41,6.99 75.06,6.99 73.79,8.26 73.79,15.11 62.87,15.11 61.09,13.34 57.91,13.34
  pour Top (isolate 0.61): 134.62,97.28 134.62,61.72 145.03,61.72 145.03,89.66 147.57,92.2 154.69,92.2 154.69,97.28
-12V_OUT_1
  Top 0.406: 37.59,87 C5.1
  Top 1.778: L2.2 C6.1 37.59,87 | X1.3 32.51,84.45 34.92,86.86 C5.1
-12V_OUT_2
  Top 0.406: 37.59,62.87 C17.1
  Top 1.778: L6.2 C18.1 37.59,62.87 | X2.3 32.51,60.33 34.92,62.73 C17.1
-12V_OUT_3
  Top 0.406: 37.59,38.73 C29.1
  Top 1.778: L10.2 C30.1 37.59,38.73 | X3.3 32.51,36.2 34.92,38.6 C29.1
-12V_OUT_4
  Top 0.406: 37.59,14.61 C41.1
  Top 1.778: L14.2 C42.1 37.59,14.61 | X4.3 32.51,12.06 34.92,14.47 C41.1
GND  (via drill 0.6)
  Top 0.406: v16.64,21.59 29.97,21.59 32.51,24.13 87.76,24.13 89.66,22.23 v126.49,22.23 | v35.05,28.57 36.96,26.67 62.36,26.67 62.99,26.04 126.75,26.04 v128.02,27.3 | v16.64,45.72 29.97,45.72 32.51,48.26 87.76,48.26 89.66,46.35 v129.03,46.35 | v129.03,70.8 88.71,70.8 87.12,72.39 32.51,72.39 29.97,69.85 v16.64,69.85 | v35.05,52.7 36.96,50.8 61.72,50.8 62.36,50.16 127.76,50.16 v129.03,51.44 | v35.69,76.83 37.59,74.93 62.36,74.93 62.99,74.3 127.76,74.3 v129.03,75.56
  Top 1.016: C13.2 v47.12,58.1 | C14.2 37.4,58.1 v35.05,58.1 | C17.2 37.46,65.41 v35.05,65.41 | C16.2 48.71,65.72 v47.12,65.72 | C19.2 v102.36,54.61 | v90.93,53.34 C20.2 | C22.2 v102.36,61.59 | C23.2 90.75,62.55 v88.39,62.55 | C10.2 v102.36,85.72 | C11.2 90.75,86.68 v88.39,86.68 | C7.2 v102.36,78.74 | v90.93,77.47 C8.2 | C5.2 37.46,89.53 v35.05,89.53 | C4.2 48.71,89.85 v47.12,89.85 | C1.2 v47.12,82.23 | C3.2 37.4,82.23 v35.05,82.23 | C25.2 v47.12,33.97 | C26.2 37.4,33.97 v35.05,33.97 | C29.2 37.46,41.27 v35.05,41.27 | C28.2 48.71,41.59 v47.12,41.59 | C31.2 v102.36,30.48 | v90.93,29.21 C32.2 | C34.2 v102.36,37.47 | C35.2 90.75,38.42 v88.39,38.42 | C37.2 v47.12,9.84 | C38.2 37.4,9.84 v35.05,9.84 | C41.2 37.46,17.14 v35.05,17.14 | C40.2 48.71,17.46 v47.12,17.46 | C43.2 v102.36,6.35 | v90.93,5.08 C44.2 | C46.2 v102.36,13.34 | C47.2 90.75,14.29 v88.39,14.29
  Top 1.27: U$18.P$1 138.18,56.9 | 138.18,56.9 C49.2 | C50.2 138.18,53.85 138.18,56.9
  Bottom 1.778: X4.1 35.69,6.99 | X3.1 36.32,31.11 | X2.1 35.69,55.24 | X1.1 36.96,79.38
  Bottom 2.54: 133.86,81.28 139.45,81.28 | 133.1,60.96 138.18,60.96 | 132.84,37.08 138.43,37.08 | 137.41,28.45 131.06,20.57
  other vias: 136.4,54.1 136.4,56.9
  pour Bottom (isolate 0.305): 134.87,91.69 135.38,92.2 156.72,92.2 157.23,91.69 157.48,16 156.72,15.24 135.64,15.24 134.87,16
  pour Bottom: 33.78,71.44 134.62,71.44 134.62,51.12 33.78,51.12
  pour Bottom: 33.78,46.67 134.62,46.67 134.62,26.99 33.78,26.99
  pour Bottom: 33.78,22.54 134.62,22.54 134.62,2.86 33.78,2.86
  pour Bottom: 33.78,96.2 134.62,96.2 134.62,75.25 33.78,75.25
  pour Top (isolate 0.61): 134.37,58.93 138.43,58.93 138.43,55.37 138.43,54.61 140.97,54.61 140.97,51.05 139.45,51.05 134.37,51.05

### Text on the board
tPlace: CH1 | -5V | -12V | CH2 | -12V | -5V | +12V | +5V | CH3 | -12V | -5V | +12V | +5V | +12V | CH4 | -12V | -5V | +12V | +5V
bPlace: 250 mA max per line | Pinout: / 1. Gnd / 2. +12V / 3. -12V / 4. +5V / 5. -5V | PDU_v1b / Laura Fleming / MFE 3/2015 | Power Distribution Board | UW-M
tNames: U1